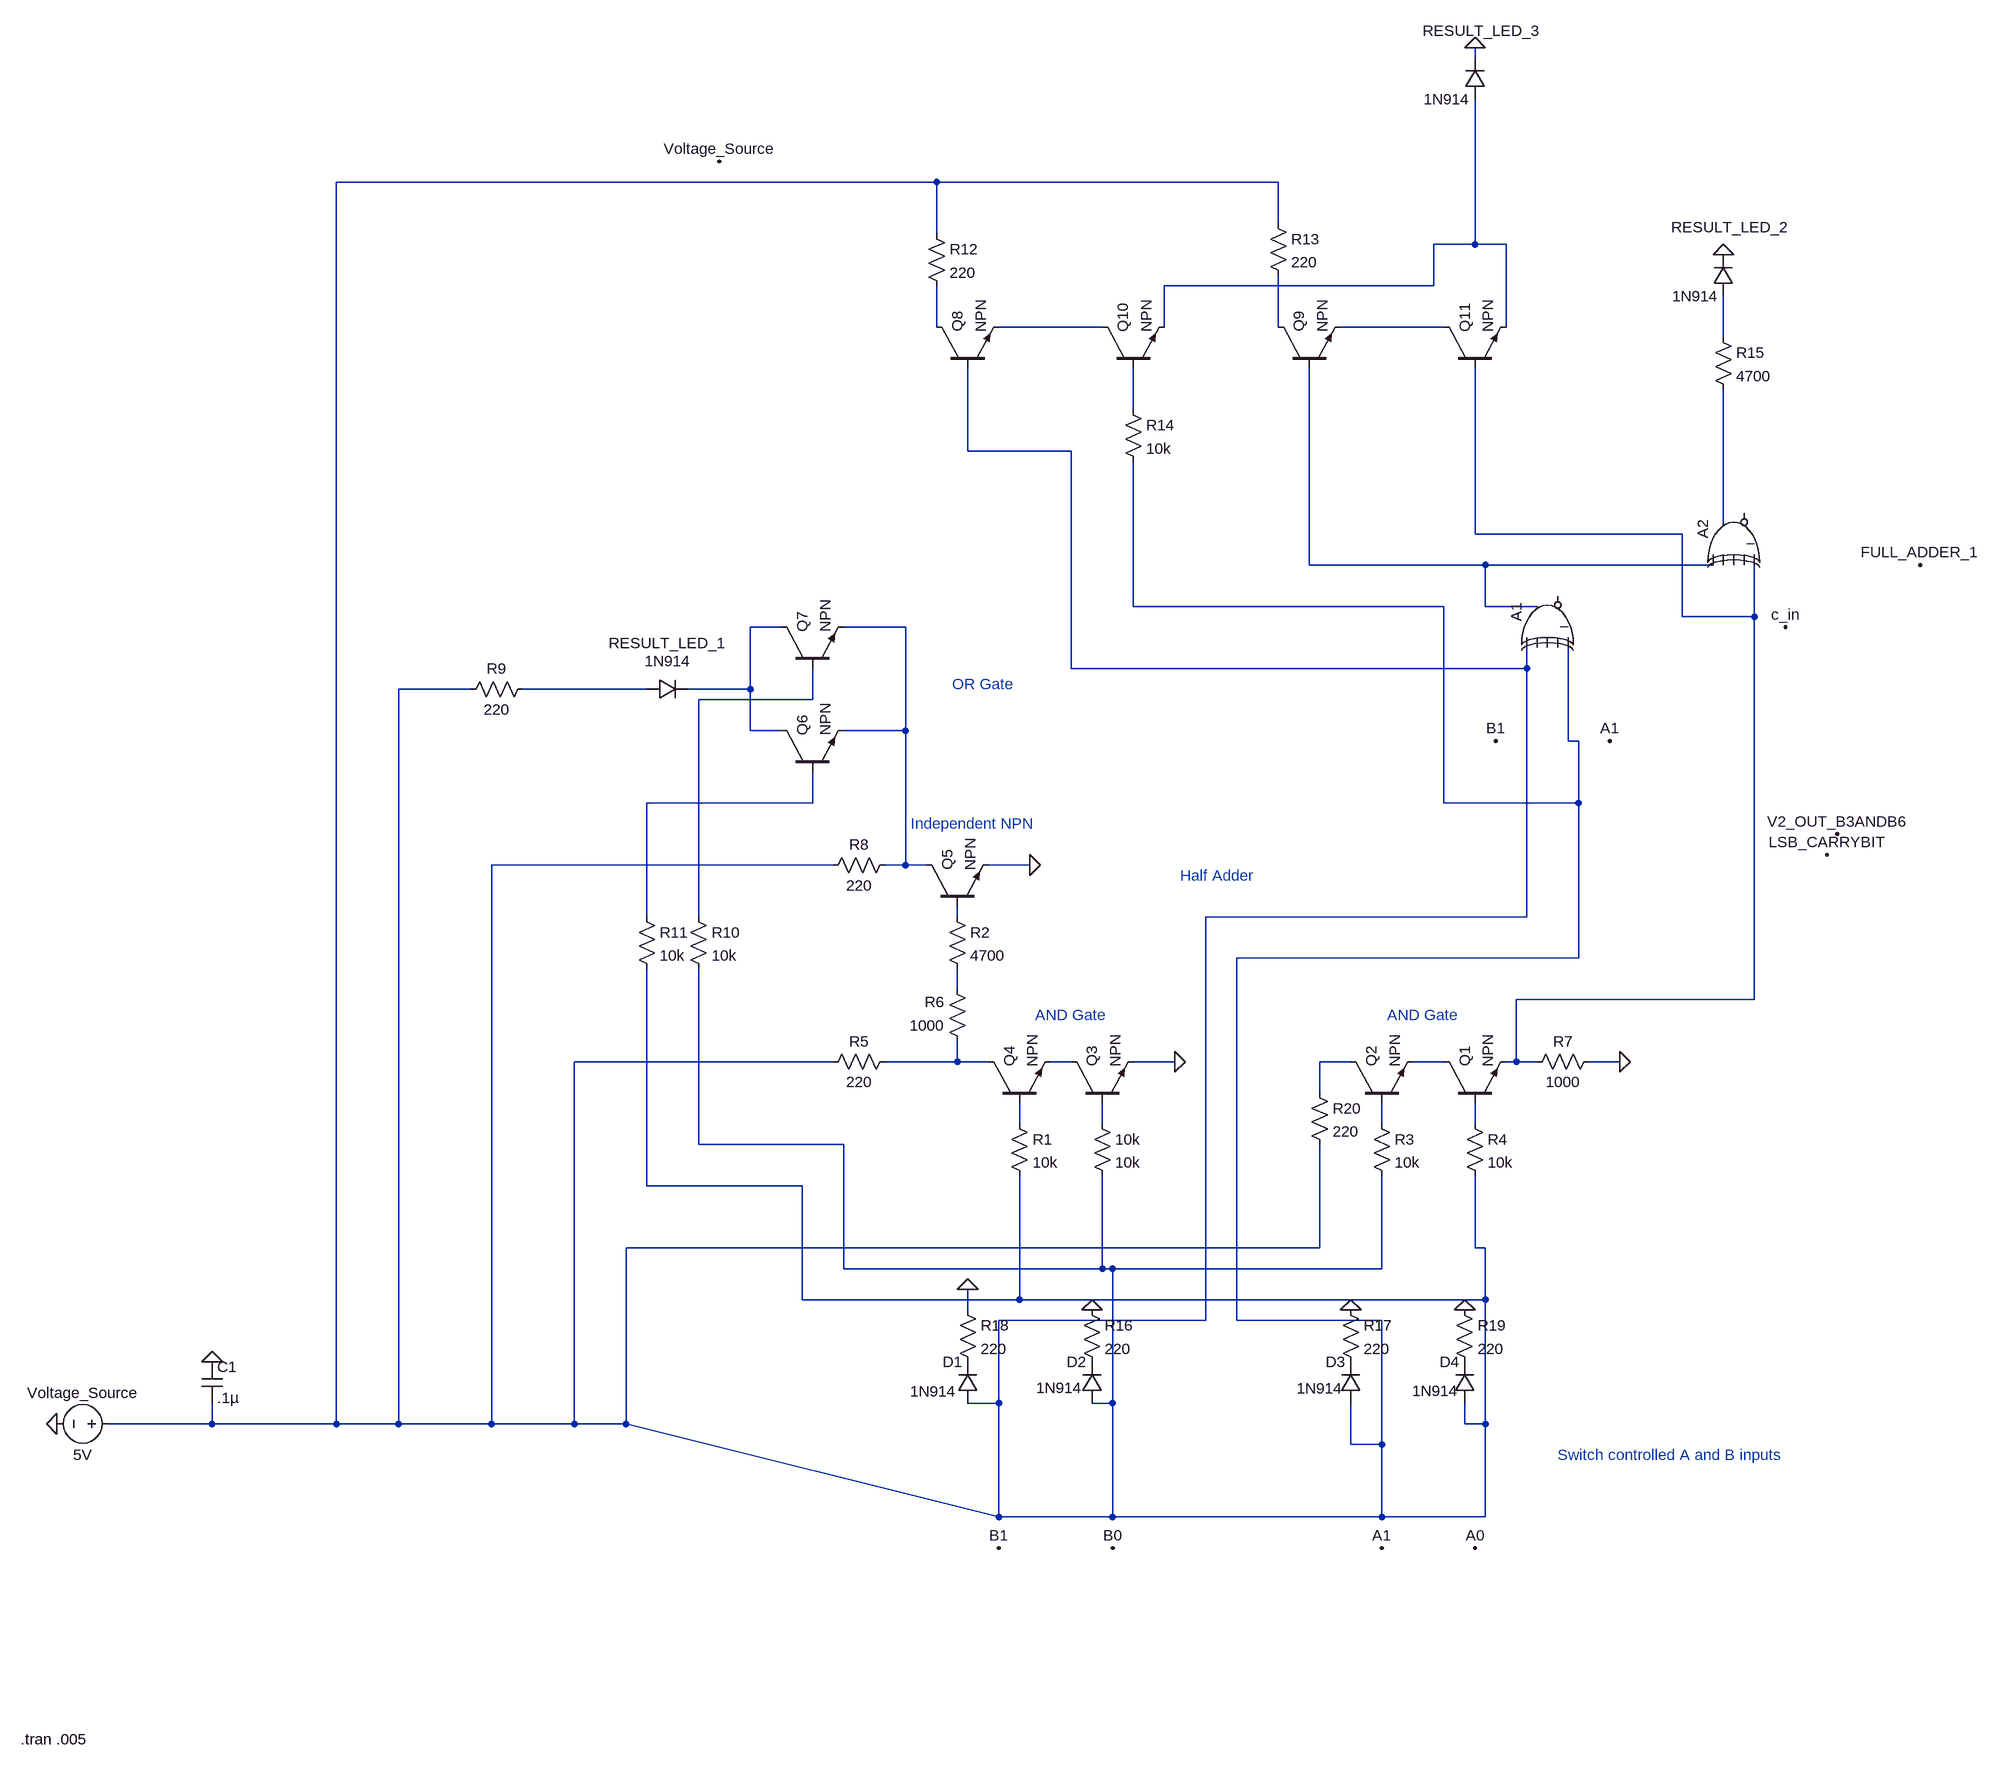
[diagram p0: schematic 304projectSchematic.asc]
304projectSchematic.asc, the LTspice schematic file:
Version 4
SHEET 1 1420 1144
WIRE 576 -1472 576 -1488
WIRE -256 -1280 -1184 -1280
WIRE 272 -1280 -256 -1280
WIRE 272 -1216 272 -1280
WIRE -256 -1200 -256 -1280
WIRE 576 -1184 576 -1408
WIRE 576 -1184 512 -1184
WIRE 624 -1184 576 -1184
WIRE 512 -1120 512 -1184
WIRE 512 -1120 96 -1120
WIRE -256 -1056 -256 -1120
WIRE 0 -1056 -160 -1056
WIRE 96 -1056 96 -1120
WIRE 272 -1056 272 -1136
WIRE 528 -1056 368 -1056
WIRE 624 -1056 624 -1184
WIRE 960 -1040 960 -1104
WIRE 48 -928 48 -992
WIRE -208 -864 -208 -992
WIRE -48 -864 -208 -864
WIRE 960 -752 960 -960
WIRE 576 -736 576 -992
WIRE 896 -736 576 -736
WIRE 320 -688 320 -992
WIRE 592 -688 320 -688
WIRE 944 -688 592 -688
WIRE 48 -624 48 -848
WIRE 528 -624 48 -624
WIRE 592 -624 592 -688
WIRE 672 -624 592 -624
WIRE 896 -608 896 -736
WIRE 1008 -608 1008 -688
WIRE 1008 -608 896 -608
WIRE -496 -592 -544 -592
WIRE -304 -592 -400 -592
WIRE -48 -528 -48 -864
WIRE 656 -528 656 -560
WIRE 656 -528 -48 -528
WIRE -976 -496 -1088 -496
WIRE -704 -496 -896 -496
WIRE -544 -496 -544 -592
WIRE -544 -496 -640 -496
WIRE -448 -480 -448 -528
WIRE -448 -480 -624 -480
WIRE -544 -432 -544 -496
WIRE -496 -432 -544 -432
WIRE -304 -432 -304 -592
WIRE -304 -432 -400 -432
WIRE 720 -416 720 -560
WIRE 736 -416 720 -416
WIRE -448 -320 -448 -368
WIRE -448 -320 -704 -320
WIRE 528 -320 528 -624
WIRE 736 -320 736 -416
WIRE 736 -320 528 -320
WIRE -416 -224 -944 -224
WIRE -304 -224 -304 -432
WIRE -304 -224 -336 -224
WIRE -272 -224 -304 -224
WIRE -112 -224 -176 -224
WIRE -704 -144 -704 -320
WIRE -624 -144 -624 -480
WIRE -224 -144 -224 -160
WIRE 656 -144 656 -528
WIRE 656 -144 160 -144
WIRE 736 -80 736 -320
WIRE 736 -80 208 -80
WIRE -224 -32 -224 -64
WIRE 1008 -16 1008 -608
WIRE 1008 -16 640 -16
WIRE -416 80 -816 80
WIRE -224 80 -224 48
WIRE -224 80 -336 80
WIRE -176 80 -224 80
WIRE -48 80 -80 80
WIRE 112 80 48 80
WIRE 384 80 336 80
WIRE 528 80 480 80
WIRE 640 80 640 -16
WIRE 640 80 624 80
WIRE 672 80 640 80
WIRE 800 80 752 80
WIRE 336 128 336 80
WIRE -128 176 -128 144
WIRE 0 176 0 144
WIRE 432 176 432 144
WIRE 576 176 576 144
WIRE -624 208 -624 -64
WIRE -400 208 -624 208
WIRE -704 272 -704 -64
WIRE -464 272 -704 272
WIRE 336 368 336 208
WIRE 336 368 -736 368
WIRE 576 368 576 256
WIRE 592 368 576 368
WIRE -400 400 -400 208
WIRE 0 400 0 256
WIRE 0 400 -400 400
WIRE 16 400 0 400
WIRE 432 400 432 256
WIRE 432 400 16 400
WIRE -464 448 -464 272
WIRE -128 448 -128 256
WIRE -128 448 -464 448
WIRE 592 448 592 368
WIRE 592 448 -128 448
WIRE -208 464 -208 432
WIRE 160 480 160 -144
WIRE 160 480 -160 480
WIRE 208 480 208 -80
WIRE 432 480 208 480
WIRE -160 608 -160 480
WIRE -160 608 -208 608
WIRE 16 608 16 400
WIRE 16 608 -16 608
WIRE -1376 640 -1376 608
WIRE -1376 640 -1536 640
WIRE -1184 640 -1184 -1280
WIRE -1184 640 -1376 640
WIRE -1088 640 -1088 -496
WIRE -1088 640 -1184 640
WIRE -944 640 -944 -224
WIRE -944 640 -1088 640
WIRE -816 640 -816 80
WIRE -816 640 -944 640
WIRE -736 640 -736 368
WIRE -736 640 -816 640
WIRE 560 640 560 608
WIRE 592 640 592 448
WIRE 592 640 560 640
WIRE 384 672 384 608
WIRE 432 672 432 480
WIRE 432 672 384 672
WIRE -160 784 -160 608
WIRE -160 784 -736 640
WIRE 16 784 16 608
WIRE 16 784 -160 784
WIRE 432 784 432 672
WIRE 432 784 16 784
WIRE 592 784 592 640
WIRE 592 784 432 784
FLAG 1136 -272 V2_OUT_B3ANDB6
FLAG 1120 -240 LSB_CARRYBIT
FLAG 1056 -592 c_in
FLAG 960 -1168 0
FLAG 1264 -688 FULL_ADDER_1
FLAG 112 80 0
FLAG -112 -224 0
FLAG -1616 640 0
FLAG 16 832 B0
FLAG 576 832 A0
FLAG 432 832 A1
FLAG -160 832 B1
FLAG 608 -416 B1
FLAG 784 -416 A1
FLAG -208 432 0
FLAG -16 464 0
FLAG 384 464 0
FLAG 560 464 0
FLAG -592 -1312 Voltage_Source
FLAG 576 -1488 0
FLAG -1376 544 0
FLAG 800 80 0
DATAFLAG -160 608 ""
DATAFLAG 0 608 ""
DATAFLAG 432 672 ""
DATAFLAG 592 640 ""
DATAFLAG 912 -16 ""
DATAFLAG 960 -864 ""
DATAFLAG 576 -1296 ""
DATAFLAG -800 -496 ""
SYMBOL Digital\\xor 624 -608 R270
SYMATTR InstName A1
SYMBOL Digital\\xor 912 -736 R270
SYMATTR InstName A2
SYMBOL diode 976 -1104 R180
WINDOW 0 -85 106 Left 2
WINDOW 3 24 0 Left 2
SYMATTR InstName RESULT_LED_2
SYMATTR Value 1N914
SYMATTR Description Light Emitting Diode
SYMATTR Type led
SYMBOL voltage -1520 640 R90
WINDOW 0 -32 56 VBottom 2
WINDOW 3 32 56 VTop 2
WINDOW 123 0 0 Left 0
WINDOW 39 0 0 Left 0
SYMATTR InstName Voltage_Source
SYMATTR Value 5V
SYMBOL res -144 160 R0
SYMATTR InstName R1
SYMATTR Value 10k
SYMBOL res -16 160 R0
SYMATTR InstName 10k
SYMATTR Value 10k
SYMBOL res 416 160 R0
SYMATTR InstName R3
SYMATTR Value 10k
SYMBOL res 560 160 R0
SYMATTR InstName R4
SYMATTR Value 10k
SYMBOL npn 528 144 R270
SYMATTR InstName Q1
SYMBOL npn 384 144 R270
SYMATTR InstName Q2
SYMBOL npn -48 144 R270
SYMATTR InstName Q3
SYMBOL npn -176 144 R270
SYMATTR InstName Q4
SYMBOL res -320 64 R90
WINDOW 0 0 56 VBottom 2
WINDOW 3 32 56 VTop 2
SYMATTR InstName R5
SYMATTR Value 220
SYMBOL res -208 64 R180
WINDOW 0 36 76 Left 2
WINDOW 3 36 40 Left 2
SYMATTR InstName R6
SYMATTR Value 1000
SYMBOL res 768 64 R90
WINDOW 0 0 56 VBottom 2
WINDOW 3 32 56 VTop 2
SYMATTR InstName R7
SYMATTR Value 1000
SYMBOL res -240 -160 R0
SYMATTR InstName R2
SYMATTR Value 4700
SYMBOL npn -272 -160 R270
SYMATTR InstName Q5
SYMBOL res -320 -240 R90
WINDOW 0 0 56 VBottom 2
WINDOW 3 32 56 VTop 2
SYMATTR InstName R8
SYMATTR Value 220
SYMBOL npn -496 -368 R270
SYMATTR InstName Q6
SYMBOL npn -496 -528 R270
SYMATTR InstName Q7
SYMBOL res -880 -512 R90
WINDOW 0 0 56 VBottom 2
WINDOW 3 32 56 VTop 2
SYMATTR InstName R9
SYMATTR Value 220
SYMBOL diode -704 -480 R270
WINDOW 0 72 32 VTop 2
WINDOW 3 44 32 VTop 2
SYMATTR InstName RESULT_LED_1
SYMATTR Value 1N914
SYMATTR Description Light Emitting Diode
SYMATTR Type led
SYMBOL res -640 -160 R0
SYMATTR InstName R10
SYMATTR Value 10k
SYMBOL res -720 -160 R0
SYMATTR InstName R11
SYMATTR Value 10k
SYMBOL res -272 -1216 R0
SYMATTR InstName R12
SYMATTR Value 220
SYMBOL diode 0 608 R180
WINDOW 0 24 64 Left 2
WINDOW 3 31 24 Left 2
SYMATTR InstName D2
SYMATTR Value 1N914
SYMATTR Description Light Emitting Diode
SYMATTR Type led
SYMBOL diode 576 608 R180
WINDOW 0 24 64 Left 2
WINDOW 3 26 19 Left 2
SYMATTR InstName D4
SYMATTR Value 1N914
SYMATTR Description Light Emitting Diode
SYMATTR Type led
SYMBOL diode -192 608 R180
WINDOW 0 24 64 Left 2
WINDOW 3 34 18 Left 2
SYMATTR InstName D1
SYMATTR Value 1N914
SYMATTR Description Light Emitting Diode
SYMATTR Type led
SYMBOL res 256 -1232 R0
SYMATTR InstName R13
SYMATTR Value 220
SYMBOL npn -256 -992 R270
SYMATTR InstName Q8
SYMBOL npn 272 -992 R270
SYMATTR InstName Q9
SYMBOL npn 0 -992 R270
SYMATTR InstName Q10
SYMBOL npn 528 -992 R270
SYMATTR InstName Q11
SYMBOL res 32 -944 R0
SYMATTR InstName R14
SYMATTR Value 10k
SYMBOL res 944 -1056 R0
SYMATTR InstName R15
SYMATTR Value 4700
SYMBOL diode 592 -1408 R180
WINDOW 0 -85 106 Left 2
WINDOW 3 24 0 Left 2
SYMATTR InstName RESULT_LED_3
SYMATTR Value 1N914
SYMATTR Description Light Emitting Diode
SYMATTR Type led
SYMBOL cap -1392 544 R0
SYMATTR InstName C1
SYMATTR Value .1µ
SYMBOL res -32 448 R0
SYMATTR InstName R16
SYMATTR Value 220
SYMBOL res -224 448 R0
SYMATTR InstName R18
SYMATTR Value 220
SYMBOL res 544 448 R0
SYMATTR InstName R19
SYMATTR Value 220
SYMBOL diode 400 608 R180
WINDOW 0 24 64 Left 2
WINDOW 3 28 23 Left 2
SYMATTR InstName D3
SYMATTR Value 1N914
SYMATTR Description Light Emitting Diode
SYMATTR Type led
SYMBOL res 368 448 R0
SYMATTR InstName R17
SYMATTR Value 220
SYMBOL res 320 112 R0
SYMATTR InstName R20
SYMATTR Value 220
TEXT 704 688 Left 2 ;Switch controlled A and B inputs
TEXT 120 -208 Left 2 ;Half Adder
TEXT 440 8 Left 2 ;AND Gate
TEXT -104 8 Left 2 ;AND Gate
TEXT -232 -504 Left 2 ;OR Gate
TEXT -296 -288 Left 2 ;Independent NPN
TEXT -1672 1128 Left 2 !.tran .005

The netlist it stands for:
* 304projectSchematic.asc
A1 N001 0 0 0 N001 0 N011 0 XOR
A2 N011 0 0 0 N010 0 N009 0 XOR
D§RESULT_LED_2 N007 0 1N914
Voltage_Source N001 0 5V
R1 N023 N001 10k
R§10k N024 N001 10k
R3 N025 N001 10k
R4 N026 N001 10k
Q1 N022 N026 N010 0 NPN
Q2 N021 N025 N022 0 NPN
Q3 N020 N024 0 0 NPN
Q4 N019 N023 N020 0 NPN
R5 N019 N001 220
R6 N019 N018 1000
R7 0 N010 1000
R2 N017 N018 4700
Q5 N013 N017 0 0 NPN
R8 N013 N001 220
Q6 N012 N016 N013 0 NPN
Q7 N012 N015 N013 0 NPN
R9 N014 N001 220
D§RESULT_LED_1 N014 N012 1N914
R10 N015 N001 10k
R11 N016 N001 10k
R12 N001 N003 220
D2 N001 P001 1N914
D4 N001 P002 1N914
D1 N001 P003 1N914
R13 N001 N005 220
Q8 N003 N001 N004 0 NPN
Q9 N005 N011 N006 0 NPN
Q10 N004 N008 N002 0 NPN
Q11 N006 N010 N002 0 NPN
R14 N008 N001 10k
R15 N007 N009 4700
D§RESULT_LED_3 N002 0 1N914
C1 0 N001 .1µ
R16 0 P001 220
R18 0 P003 220
R19 0 P002 220
D3 N001 P004 1N914
R17 0 P004 220
R20 N021 N001 220
.model D D
.lib standard.dio
.model NPN NPN
.model PNP PNP
.lib standard.bjt
* Switch controlled A and B inputs
* Half Adder
* AND Gate
* AND Gate
* OR Gate
* Independent NPN
.tran .005
.backanno
.end